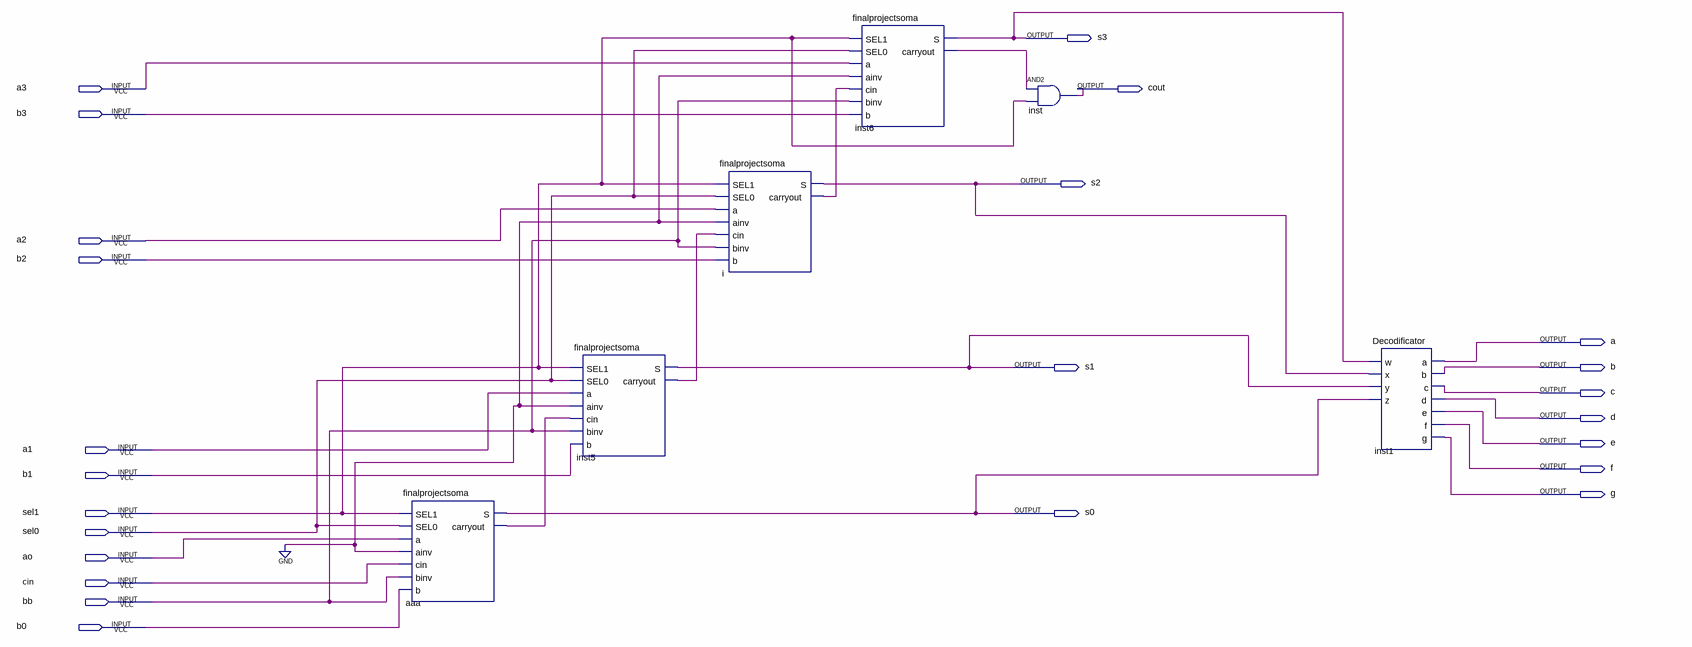
[diagram p0: schematic sheet]
// Quartus schematic projetoula.bdf as structural Verilog: 6 symbols, 24 pins
module projetoula (
  input  a3,
  input  b3,
  input  a2,
  input  b2,
  input  a1,
  input  b1,
  input  sel1,
  input  sel0,
  input  ao,
  input  cin,
  input  bb,
  input  b0,
  output s3,
  output cout,
  output s2,
  output a,
  output s1,
  output b,
  output c,
  output d,
  output e,
  output f,
  output g,
  output s0
);

  wire aaa_carryout, i_carryout, inst5_carryout, inst6_carryout;

  finalprojectsoma aaa (
    .SEL1(sel1), .SEL0(sel0), .a(ao), .ainv(1'b0), .cin(cin), .binv(bb), .b(b0), .S(s0),
    .carryout(aaa_carryout));
  finalprojectsoma inst5 (
    .SEL1(sel1), .SEL0(sel0), .a(a1), .ainv(1'b0), .cin(aaa_carryout), .binv(bb), .b(b1), .S(s1),
    .carryout(inst5_carryout));
  finalprojectsoma i (
    .SEL1(sel1), .SEL0(sel0), .a(a2), .ainv(1'b0), .cin(inst5_carryout), .binv(bb), .b(b2), .S(s2),
    .carryout(i_carryout));
  finalprojectsoma inst6 (
    .SEL1(sel1), .SEL0(sel0), .a(a3), .ainv(1'b0), .cin(i_carryout), .binv(bb), .b(b3), .S(s3),
    .carryout(inst6_carryout));
  and inst (cout, inst6_carryout, sel1);
  Decodificator inst1 (.w(s3), .x(s2), .y(s1), .z(s0), .a(a), .b(b), .c(c), .d(d), .e(e), .f(f), .g(g));
endmodule
